# EAGLE design TI_DMM_PCB (EAGLE 9.6.2)
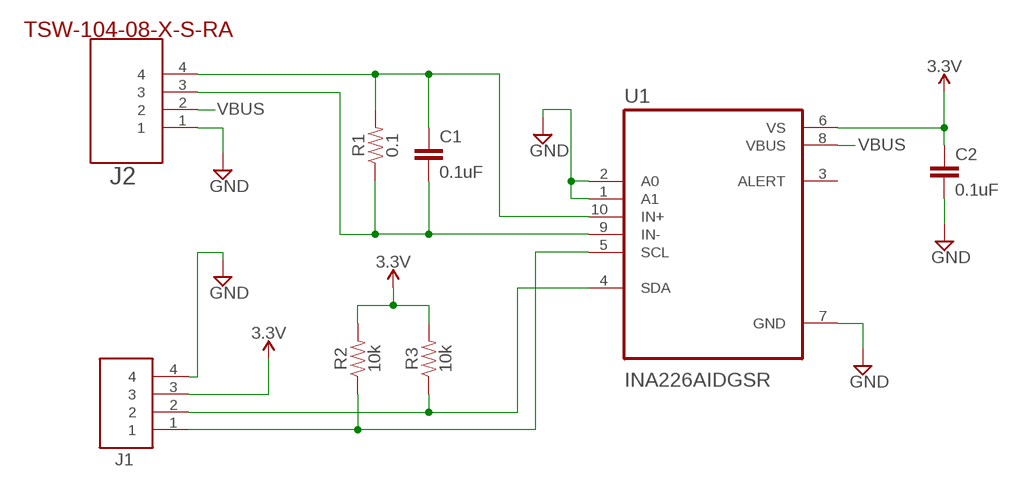
[diagram p0: schematic, sheet 1]

## Parts
C1  0.1uF  0.1UF-0603  [0603]
C2  0.1uF  0.1UF-0603  [0603]
J1  4PIN_GROVE_CONNECTOR  [SEEED_114020163]
J2  TSW-104-08-X-S-RAJ  [SAMTEC-TSW-104-08-X-S-RA]
R1  0.1  0.1OHM  [0603]
R2  10k  10KOHM-0603  [0603]
R3  10k  10KOHM-0603  [0603]
U1  INA226AIDGSR  [SOP50P490X110-10N]

## Nets
3.3V: C2.1 J1.3 R2.2 R3.2 U1.6(VS)
GND: C2.2 J1.4 J2.1 U1.1(A1) U1.2(A0) U1.7(GND)
IN+: C1.1 J2.4 R1.2 U1.10(IN+)
IN-: C1.2 J2.3 R1.1 U1.9(IN-)
SCL: J1.1 R2.1 U1.5(SCL)
SDA: J1.2 R3.1 U1.4(SDA)
VBUS: J2.2 U1.8(VBUS)
Unconnected: U1.3(ALERT)

## Library data of the parts
C1 C2 = MyLib_06_14:0.1UF: 0.1uF ceramic capacitors A capacitor is a passive two-terminal electrical component used to store electrical energy temporarily in an electric field.
J1 = MyLib_06_14:4PIN_GROVE_CONNECTOR: Check prices <https://pricing.snapeda.com/parts/110990030/Seeed%20Technology%20Co.%2C%20Ltd/view-part?ref=eda>; AVAILABILITY: In Stock; DESCRIPTION: GROVE 2MM 4PIN VERT CONN 10PCS; MF: Seeed Technology Co., Ltd; MP: 110990030; PACKAGE: None; PRICE: None; PURCHASE-URL: https://pricing.snapeda.com/search/part/110990030/?ref=eda
J2 = MyLib_06_14:TSW-104-08-X-S-RA: TSW - Samtec 2.54mm Right Angle Through Hole Header 2.29mm Solder Tail (08) - Fast Stock. 4 pin Connector Header. Check prices <https://pricing.snapeda.com/parts/TSW-104-08-T-S-RA/Samtec/view-part?ref=eda>; AVAILABILITY: In Stock; DESCRIPTION: TSW - Samtec 2.54mm Right Angle Through Hole Header 2.29mm Solder Tail (08) - Fast Stock; MF: Samtec; MP: TSW-104-08-T-S-RA; PACKAGE: None; PRICE: None; PURCHASE-URL: https://pricing.snapeda.com/search/part/TSW-104-08-T-S-RA/?ref=eda
R1 = MyLib_06_14:0.1OHM: Res Thick Film 0402 1M Ohm 1% 1/16W ±100ppm/°C Molded SMD Paper T/R Check prices <https://pricing.snapeda.com/parts/AC0402FR-071ML/Yageo/view-part?ref=eda>
R2 R3 = MyLib_06_14:10KOHM: 10kohm resistor A resistor is a passive two-terminal electrical component that implements electrical resistance as a circuit element. Resistors act to reduce current flow, and, at the same time, act to lower voltage levels within circuits. - Wikipedia
U1 = INA226AIDGSR:INA226AIDGSR: Check prices <https://pricing.snapeda.com/parts/INA226AIDGSR/Texas%20Instruments/view-part?ref=eda>; AVAILABILITY: In Stock; DESCRIPTION: 36V, 16-bit, ultra-precise i2c output current/voltage/power monitor w/alert 10-VSSOP -40 to 125; MF: Texas Instruments; MP: INA226AIDGSR; PACKAGE: VSSOP-10 Texas Instruments; PRICE: None; PURCHASE-URL: https://pricing.snapeda.com/search/part/INA226AIDGSR/?ref=eda

## Board
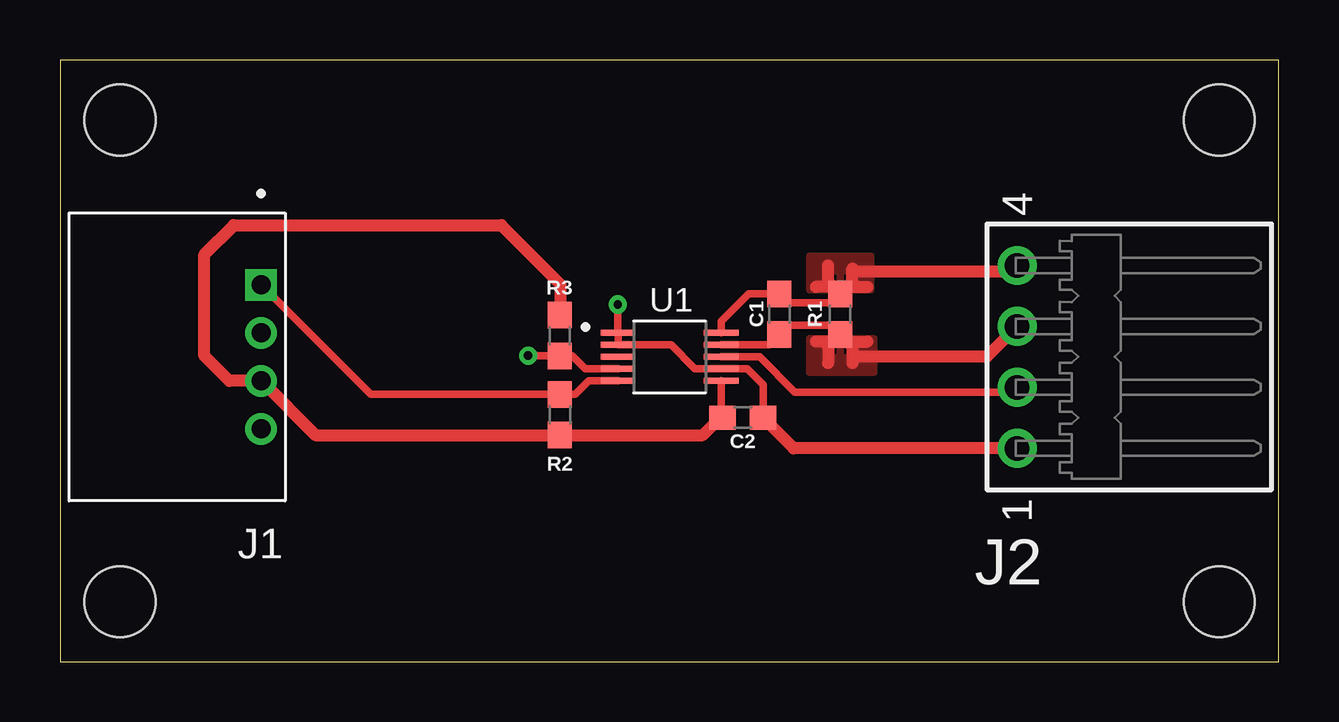
[diagram p1: board, top side]
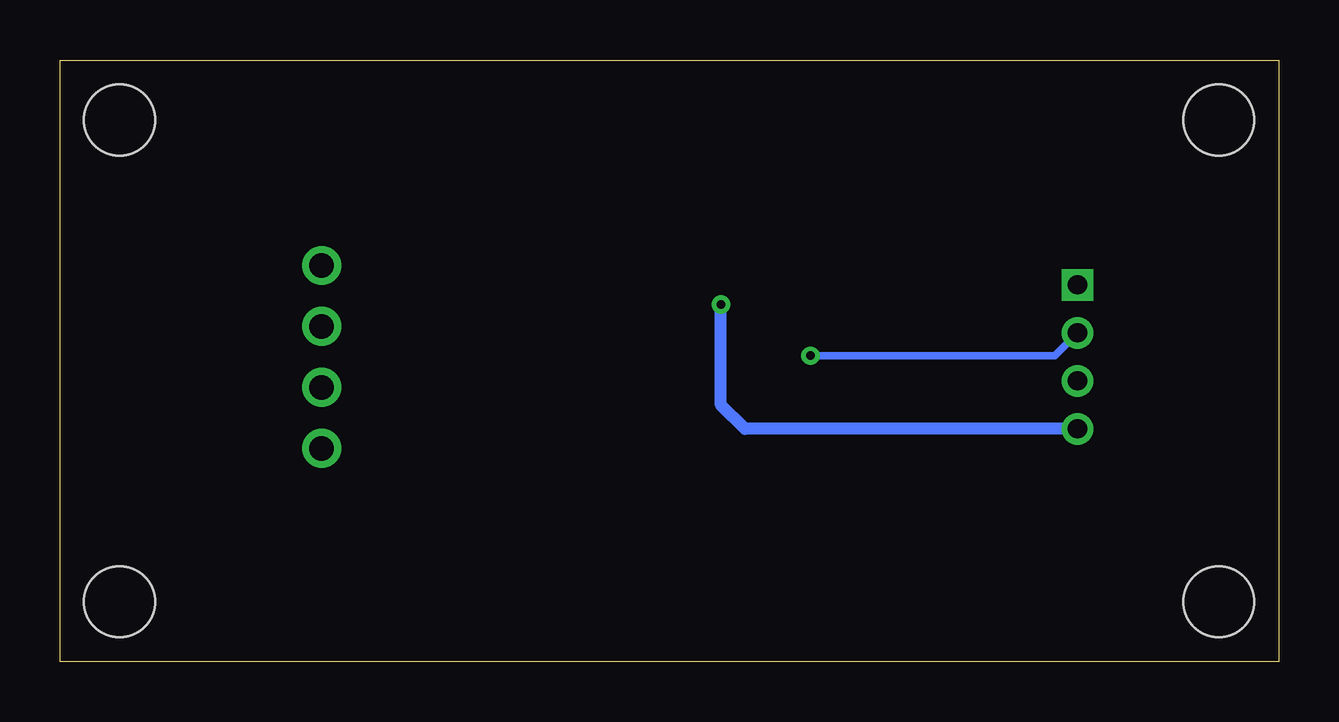
[diagram p2: board, bottom side, seen from below]

Size 50.78 x 25.07 mm. Coordinates in mm from the lower left corner, seen from the top.
Outline: 0,0 50.78,0 50.78,25.07 0,25.07 0,0
Copper layers (1*16): Top 0.035mm / dielectric 1.5mm / Bottom 0.035mm
Design rules "default *": minimum track width 6mil, minimum drill 0.35mm, track to track 6mil, track to pad 6mil, pad to pad 6mil, via to via 6mil, smd to smd 0mil, copper to edge 40mil, drill to drill 6mil, minimum pad ring 10mil, minimum via ring 8mil, stop-mask expansion 4mil, vias tented up to drill 0mil, thermal gap 10mil
Holes 2.95 mm at 2.5,22.57 2.5,2.5 48.3,2.5 48.3,22.57

### Footprints (pad centres in the part's own frame; a part is rotated, then mirrored left to right if it is on the bottom)
0603 = smd 1.1 x 1: 1 -0.85,0; 2 0.85,0
SEEED_114020163 = drill 0.8 square: 1 -3,0 | drill 0.8: 2 -1,0; 3 1,0; 4 3,0
SAMTEC-TSW-104-08-X-S-RA = drill 1.02 pad 1.62: 1 -3.81,3.048; 2 -1.27,3.048; 3 1.27,3.048; 4 3.81,3.048
SOP50P490X110-10N = smd 1.47 x 0.28: 1 -2.15,1; 2 -2.15,0.5; 3 -2.15,0; 4 -2.15,-0.5; 5 -2.15,-1; 6 2.15,-1; 7 2.15,-0.5; 8 2.15,0; 9 2.15,0.5; 10 2.15,1

### Placement (x,y rotation side)
C1  29.97,14.48 270 top
C2  28.45,10.16 0 top
J1  8.38,12.7 270 top
J2  42.93,12.7 90 top
R1  32.51,14.48 90 top
R2  20.83,10.29 270 top
R3  20.83,13.59 90 top
U1  25.4,12.7 0 top

### Tracks (layer width: path | path; a pad name or v marks a point on that pad's centre or on a via)
3.3V
  Top 0.305: U1.6 27.55,10.21 C2.1
  Top 0.508: 27.55,10.21 26.78,9.44 R2.2 10.64,9.44 J1.3 7.06,11.7 6.02,12.74 6.02,16.97 7.24,18.19 18.39,18.19 20.85,15.72 20.85,14.46 R3.2
GND  (via drill 0.35)
  Top 0.305: C2.2 29.3,11.54 28.64,12.2 U1.7 27.54,12.21 26.45,12.21 25.46,13.2 U1.2 U1.1 v23.24,14.88
  Top 0.508: J2.1 30.57,8.89 C2.2
  Bottom 0.508: J1.4 22.25,9.7 23.24,10.69 v23.24,14.88
IN+
  Top 0.305: R1.2 32.13,14.95 30.35,14.95 C1.1 28.7,15.33 27.55,14.18 U1.10
  Top 0.508: 32.77,15.07 R1.2 | R1.2 32.22,15.62 31.5,15.62 | R1.2 32.8,15.62 33.66,15.62 | R1.2 33.02,15.84 33.02,16.26 | 33.02,16.26 33.02,16.38 | R1.2 32,15.84 32,16.51 | J2.4 39.62,16.26 33.02,16.26
  pour Top: 31.24,16.89 31.24,15.49 33.78,15.49 33.78,16.89
IN-
  Top 0.305: R1.1 32.13,14.01 30.35,14.01 C1.2 29.54,13.2 U1.9
  Top 0.508: 32.77,13.88 R1.1 | R1.1 32.22,13.34 31.5,13.34 | R1.1 32.8,13.34 33.66,13.34 | R1.1 32,13.12 32,12.45 | R1.1 33.02,13.12 33.02,12.7 | 33.02,12.7 33.02,12.45 | J2.3 38.61,12.7 33.02,12.7
  pour Top: 31.24,13.46 31.24,12.06 33.91,12.06 33.91,13.46
SCL
  Top 0.305: J1.1 12.95,11.14 R2.1 21.46,11.14 22.03,11.7 U1.5
SDA  (via drill 0.35)
  Top 0.305: U1.4 21.88,12.2 21.34,12.74 R3.1 20.82,12.75 v19.51,12.75
  Bottom 0.305: J1.2 9.33,12.75 v19.51,12.75
VBUS
  Top 0.305: U1.8 29.15,12.7 30.62,11.23 39.67,11.23 J2.2